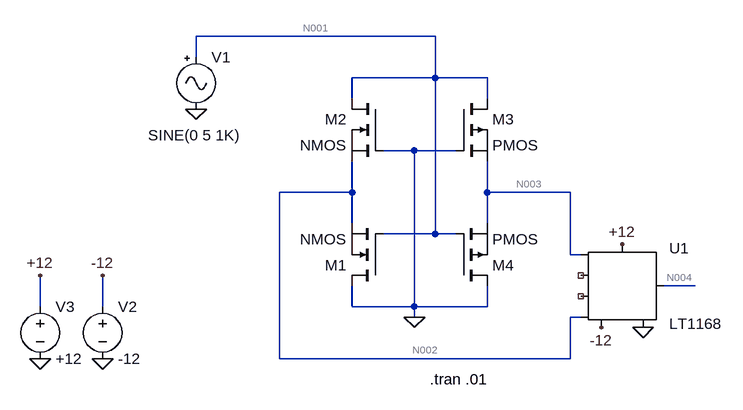
[diagram p0: schematic HW3_MOSFETRectifier.asc]
HW3_MOSFETRectifier.asc, the LTspice schematic file:
Version 4
SHEET 1 880 680
WIRE 144 -96 -224 -96
WIRE -224 -64 -224 -96
WIRE 144 -32 144 -96
WIRE 144 -32 16 -32
WIRE 224 -32 144 -32
WIRE 16 0 16 -32
WIRE 224 0 224 -32
WIRE 112 80 64 80
WIRE 176 80 112 80
WIRE 16 144 16 96
WIRE 16 144 -96 144
WIRE 224 144 224 96
WIRE 352 144 224 144
WIRE 16 192 16 144
WIRE 224 192 224 144
WIRE 144 208 144 -32
WIRE 144 208 64 208
WIRE 176 208 144 208
WIRE 352 240 352 144
WIRE 368 240 352 240
WIRE 544 288 496 288
WIRE -464 320 -464 272
WIRE -368 320 -368 272
WIRE 16 320 16 288
WIRE 112 320 112 80
WIRE 112 320 16 320
WIRE 224 320 224 288
WIRE 224 320 112 320
WIRE 112 336 112 320
WIRE 368 336 352 336
WIRE -96 400 -96 144
WIRE 352 400 352 336
WIRE 352 400 -96 400
FLAG -224 16 0
FLAG 112 336 0
FLAG 464 352 0
FLAG -464 400 0
FLAG -368 400 0
FLAG -464 272 +12
FLAG -368 272 -12
FLAG 400 352 -12
FLAG 432 224 +12
SYMBOL Misc\\signal -224 -80 R0
WINDOW 3 -74 136 Left 2
WINDOW 123 0 0 Left 0
WINDOW 39 0 0 Left 0
SYMATTR Value SINE(0 5 1K)
SYMATTR InstName V1
SYMBOL OpAmps\\LT1168 432 288 R0
SYMATTR InstName U1
SYMBOL voltage -368 304 R0
WINDOW 123 0 0 Left 0
WINDOW 39 0 0 Left 0
SYMATTR InstName V2
SYMATTR Value -12
SYMBOL voltage -464 304 R0
WINDOW 123 0 0 Left 0
WINDOW 39 0 0 Left 0
SYMATTR InstName V3
SYMATTR Value +12
SYMBOL nmos 64 288 R180
SYMATTR InstName M1
SYMBOL nmos 64 0 M0
SYMATTR InstName M2
SYMBOL pmos 176 0 R0
SYMATTR InstName M3
SYMBOL pmos 176 288 M180
SYMATTR InstName M4
TEXT 136 432 Left 2 !.tran .01

The netlist it stands for:
* HW3_MOSFETRectifier.asc
V1 N001 0 SINE(0 5 1K)
XU1 NC_01 N002 N003 -12 0 N004 +12 NC_02 LT1168
V2 -12 0 -12
V3 +12 0 +12
M1 0 N001 N002 N002 NMOS
M2 N001 0 N002 N002 NMOS
M3 N001 0 N003 N003 PMOS
M4 0 N001 N003 N003 PMOS
.model NMOS NMOS
.model PMOS PMOS
.lib standard.mos
.tran .01
.lib LTC.lib
.backanno
.end

* Results of the author's LTspice run, read from the files saved beside the schematic
* Operating Point, zero values left out:
*   V(+12) = 12 V
*   V(-12) = -12 V
*   I(V2) = 350 µA
*   I(V3) = -350 µA
*   Ix(u1:4) = -350 µA
*   Ix(u1:7) = 350 µA
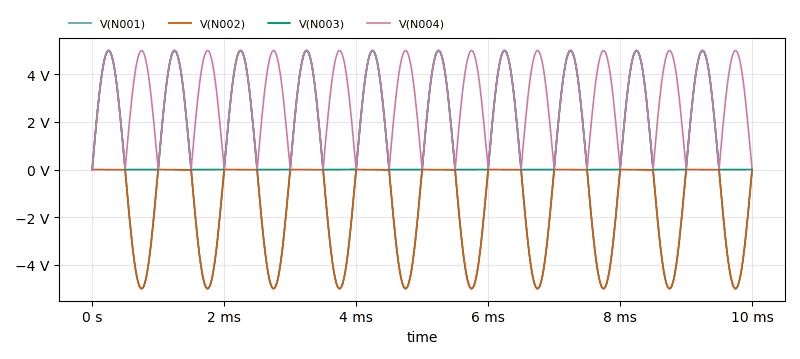
[diagram p1: Transient Analysis of HW3_MOSFETRectifier.asc, plotted from the saved traces]
* Transient Analysis, 1 run:
*   V(N001): min -4.999 V, max 5 V, average 16.82 µV, rms 3.534 V, last 0 V
*   V(N002): min -4.994 V, max 11.95 mV, average -1.588 V, rms 2.496 V, last -48.15 mV
*   V(N003): min -9.065 mV, max 4.995 V, average 1.588 V, rms 2.496 V, last 17.33 mV
*   V(N004): min 0 V, max 4.996 V, average 3.177 V, rms 3.531 V, last 63.12 mV